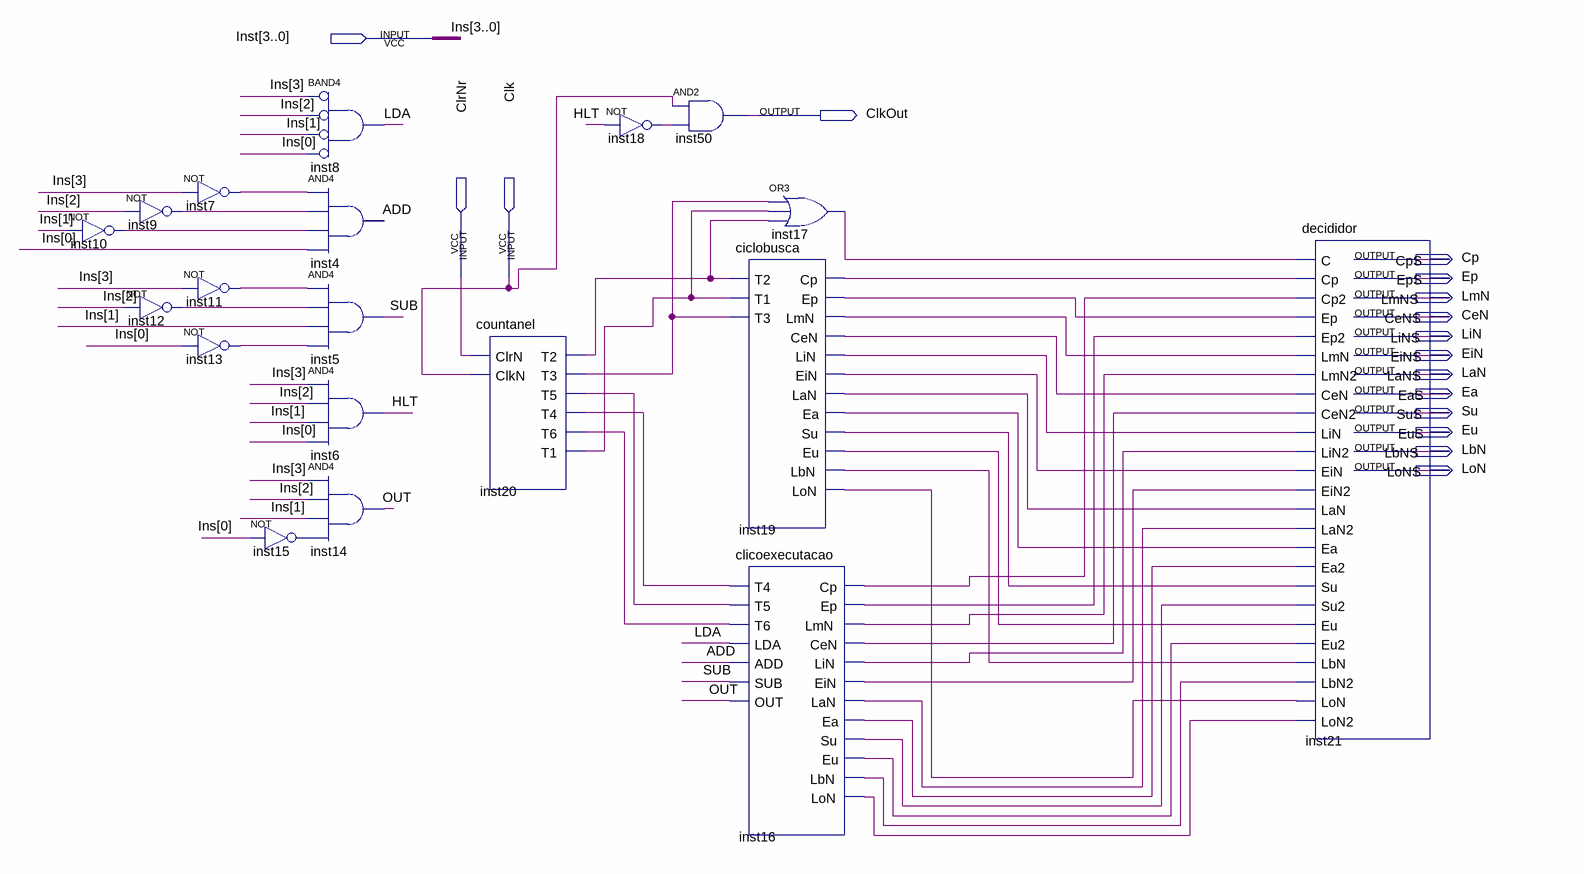
[diagram p0: schematic sheet]
// Quartus schematic control.bdf as structural Verilog: 19 symbols, 16 pins
module control (
  input  [3:0] Inst,
  input  ClrNr,
  input  Clk,
  output ClkOut,
  output Cp,
  output Ep,
  output LmN,
  output CeN,
  output LiN,
  output EiN,
  output LaN,
  output Ea,
  output Su,
  output Eu,
  output LbN,
  output LoN
);

  wire ADD, HLT, inst7_out, inst9_out, inst10_out, inst11_out, inst12_out, inst13_out, inst15_out,
       inst16_cen, inst16_cp, inst16_ea, inst16_ein, inst16_ep, inst16_eu, inst16_lan, inst16_lbn,
       inst16_lin, inst16_lmn, inst16_lon, inst16_su, inst17_out, inst18_out, inst19_cen, inst19_cp,
       inst19_ea, inst19_ein, inst19_ep, inst19_eu, inst19_lan, inst19_lbn, inst19_lin, inst19_lmn,
       inst19_lon, inst19_su, inst20_t1, inst20_t2, inst20_t3, inst20_t4, inst20_t5, inst20_t6, LDA, OUT, SUB;

  not inst10 (inst10_out, Inst[1]);
  not inst9 (inst9_out, Inst[2]);
  not inst12 (inst12_out, Inst[2]);
  not inst7 (inst7_out, Inst[3]);
  not inst11 (inst11_out, Inst[3]);
  not inst13 (inst13_out, Inst[0]);
  and inst8 (LDA, ~Inst[3], ~Inst[2], ~Inst[1], ~Inst[0]);  // BAND4
  and inst4 (ADD, inst7_out, inst9_out, inst10_out, Inst[0]);
  and inst5 (SUB, inst11_out, inst12_out, Inst[1], inst13_out);
  and inst6 (HLT, Inst[3], Inst[2], Inst[1], Inst[0]);
  and inst14 (OUT, Inst[3], Inst[2], Inst[1], inst15_out);
  not inst15 (inst15_out, Inst[0]);
  countanel inst20 (
    .ClrN(ClrNr), .ClkN(Clk), .T2(inst20_t2), .T3(inst20_t3), .T5(inst20_t5), .T4(inst20_t4), .T6(inst20_t6),
    .T1(inst20_t1));
  not inst18 (inst18_out, HLT);
  and inst50 (ClkOut, Clk, inst18_out);
  or inst17 (inst17_out, inst20_t3, inst20_t1, inst20_t2);
  ciclobusca inst19 (
    .T2(inst20_t2), .T1(inst20_t1), .T3(inst20_t3), .Cp(inst19_cp), .Ep(inst19_ep), .LmN(inst19_lmn),
    .CeN(inst19_cen), .LiN(inst19_lin), .EiN(inst19_ein), .LaN(inst19_lan), .Ea(inst19_ea), .Su(inst19_su),
    .Eu(inst19_eu), .LbN(inst19_lbn), .LoN(inst19_lon));
  clicoexecutacao inst16 (
    .T4(inst20_t4), .T5(inst20_t5), .T6(inst20_t6), .LDA(LDA), .ADD(ADD), .SUB(SUB), .OUT(OUT),
    .Cp(inst16_cp), .Ep(inst16_ep), .LmN(inst16_lmn), .CeN(inst16_cen), .LiN(inst16_lin), .EiN(inst16_ein),
    .LaN(inst16_lan), .Ea(inst16_ea), .Su(inst16_su), .Eu(inst16_eu), .LbN(inst16_lbn), .LoN(inst16_lon));
  decididor inst21 (
    .C(inst17_out), .Cp(inst19_cp), .Cp2(inst16_cp), .Ep(inst19_ep), .Ep2(inst16_ep), .LmN(inst19_lmn),
    .LmN2(inst16_lmn), .CeN(inst19_cen), .CeN2(inst16_cen), .LiN(inst19_lin), .LiN2(inst16_lin),
    .EiN(inst19_ein), .EiN2(inst16_ein), .LaN(inst19_lan), .LaN2(inst16_lan), .Ea(inst19_ea),
    .Ea2(inst16_ea), .Su(inst19_su), .Su2(inst16_su), .Eu(inst19_eu), .Eu2(inst16_eu), .LbN(inst19_lbn),
    .LbN2(inst16_lbn), .LoN(inst19_lon), .LoN2(inst16_lon), .CpS(Cp), .EpS(Ep), .LmNS(LmN), .CeNS(CeN),
    .LiNS(LiN), .EiNS(EiN), .LaNS(LaN), .EaS(Ea), .SuS(Su), .EuS(Eu), .LbNS(LbN), .LoNS(LoN));

  // Other names for the same wires on the sheet: Ins[3:0] = Inst
endmodule
